# EAGLE design RADIO (EAGLE 9.4.2)
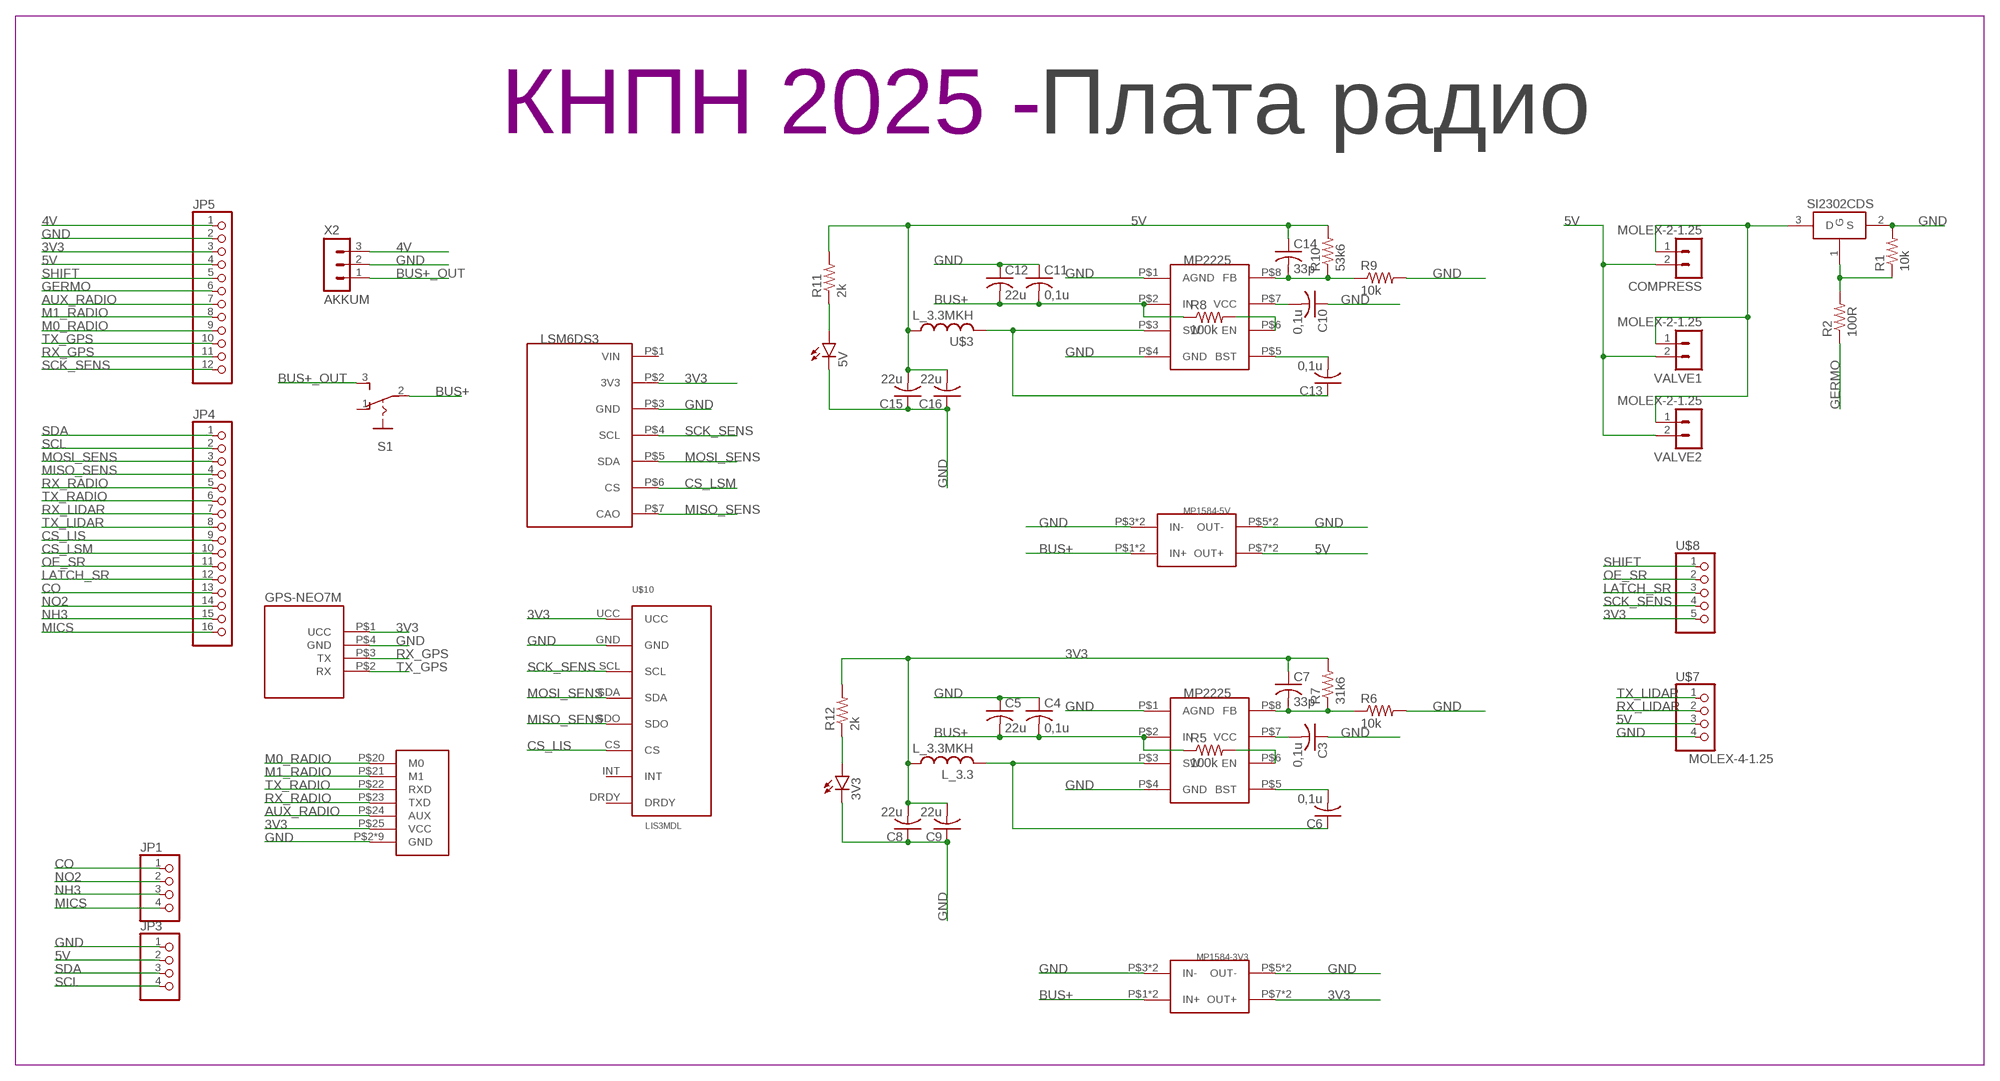
[diagram p0: schematic, sheet 1]

## Parts
3V3  LEDCHIP-LED0603  [CHIP-LED0603]
5V  LEDCHIP-LED0603  [CHIP-LED0603]
C3  0,1u  C-USC0603  [C0603]
C4  0,1u  C-USC1206  [C1206]
C5  22u  C-USC0603  [C0603]
C6  0,1u  C-USC0603  [C0603]
C7  33p  C-USC0603  [C0603]
C8  22u  C-USC1206  [C1206]
C9  22u  C-USC1206  [C1206]
C10  0,1u  C-USC0603  [C0603]
C11  0,1u  C-USC1206  [C1206]
C12  22u  C-USC0603  [C0603]
C13  0,1u  C-USC0603  [C0603]
C14  33p  C-USC0603  [C0603]
C15  22u  C-USC1206  [C1206]
C16  22u  C-USC1206  [C1206]
COMPRESS  MOLEX-2-1.25  [53047-02]
GPS-NEO7M  GPS-NEO7M  [GPS-NEO7M]
JP1  PINHD-1X4  [1X04]
JP3  PINHD-1X4  [1X04]
JP4  PINHD-1X16  [1X16]
JP5  PINHD-1X12  [1X12]
L_3.3  L_3.3MKH  L_3.3MKH_5X5  [L_SPM5020]
LSM6DS3  LSM6DS3  LSM6DS3_WITHOUT  [LSM6DS3_WITHOUT]
MP1584-3V3  MP1584-B  [MP1584-B]
MP1584-5V  MP1584  MP1584-B  [MP1584-B]
R1  10k  R-US_R0603  [R0603]
R2  100R  R-US_R0603  [R0603]
R5  100k  R-US_R0603  [R0603]
R6  10k  R-US_R0603  [R0603]
R7  31k6  R-US_R0603  [R0603]
R8  100k  R-US_R0603  [R0603]
R9  10k  R-US_R0603  [R0603]
R10  53k6  R-US_R0603  [R0603]
R11  2k  R-US_R0603  [R0603]
R12  2k  R-US_R0603  [R0603]
RADIO  E220-400T22S  [E220-400T22S]
S1  UNICS-SWITCHSS_12D11  [SS_12D11]
SI2302CDS  SI2302CDS  [SOT23-3]
U$1  Плата радио  LOGOPCB-""  [LOGO]
U$2  MP2225  [TSOT23-8]
U$3  L_3.3MKH  L_3.3MKH_5X5  [L_SPM5020]
U$5  MP2225  [TSOT23-8]
U$7  MOLEX-4-1.25  [53047-04]
U$8  MOLEX-5-1.25  [53047-05]
U$10  LIS3MDL  [LIS3MDL]
VALVE1  MOLEX-2-1.25  [53047-02]
VALVE2  MOLEX-2-1.25  [53047-02]
X2  AKKUM  JST-3-2.5  [JST-3-2.5]

## Nets
3V3: C7.1 C8.2 C9.2 GPS-NEO7M.P$1(UCC) JP5.3 L_3.3.P$1 LSM6DS3.P$2(3V3) MP1584-3V3.P$7(OUT+) MP1584-3V3.P$8(OUT+) R7.2 R12.2 RADIO.P$25(VCC) U$8.5 U$10.UCC
4V: JP5.1 X2.3
5V: C14.1 C15.2 C16.2 COMPRESS.2 JP3.2 JP5.4 MP1584-5V.P$7(OUT+) MP1584-5V.P$8(OUT+) R10.2 R11.2 U$3.P$1 U$7.3 VALVE1.2 VALVE2.2
AUX_RADIO: JP5.7 RADIO.P$24(AUX)
BUS+: C4.2 C5.2 C11.2 C12.2 MP1584-3V3.P$1(IN+) MP1584-3V3.P$2(IN+) MP1584-5V.P$1(IN+) MP1584-5V.P$2(IN+) R5.1 R8.1 S1.2(P) U$2.P$2(IN) U$5.P$2(IN)
BUS+_OUT: S1.3(S) X2.1
CO: JP1.1 JP4.13
CS_LIS: JP4.9 U$10.CS
CS_LSM: JP4.10 LSM6DS3.P$6(CS)
GERMO: JP5.6 R2.1
GND: 3V3.C 5V.C C3.1 C4.1 C5.1 C8.1 C9.1 C10.1 C11.1 C12.1 C15.1 C16.1 GPS-NEO7M.P$4(GND) JP3.1 JP5.2 LSM6DS3.P$3(GND) MP1584-3V3.P$3(IN-) MP1584-3V3.P$4(IN-) MP1584-3V3.P$5(OUT-) MP1584-3V3.P$6(OUT-) MP1584-5V.P$3(IN-) MP1584-5V.P$4(IN-) MP1584-5V.P$5(OUT-) MP1584-5V.P$6(OUT-) R1.2 R6.2 R9.2 RADIO.P$2(GND) RADIO.P$8(GND) RADIO.P$11(GND) RADIO.P$13(GND) RADIO.P$14(GND) RADIO.P$15(GND) RADIO.P$16(GND) RADIO.P$19(GND) RADIO.P$26(GND) SI2302CDS.2(S) U$2.P$1(AGND) U$2.P$4(GND) U$5.P$1(AGND) U$5.P$4(GND) U$7.4 U$10.GND X2.2
LATCH_SR: JP4.12 U$8.3
M0_RADIO: JP5.9 RADIO.P$20(M0)
M1_RADIO: JP5.8 RADIO.P$21(M1)
MICS: JP1.4 JP4.16
MISO_SENS: JP4.4 LSM6DS3.P$7(CAO) U$10.SDO
MOSI_SENS: JP4.3 LSM6DS3.P$5(SDA) U$10.SDA
N$2: R1.1 R2.2 SI2302CDS.1(G)
N$5: COMPRESS.1 SI2302CDS.3(D) VALVE1.1 VALVE2.1
N$9: C3.2 U$2.P$7(VCC)
N$10: R5.2 U$2.P$6(EN)
N$11: C6.2 U$2.P$5(BST)
N$12: C6.1 L_3.3.P$2 U$2.P$3(SW)
N$13: C7.2 R6.1 R7.1 U$2.P$8(FB)
N$14: C10.2 U$5.P$7(VCC)
N$15: R8.2 U$5.P$6(EN)
N$16: C13.2 U$5.P$5(BST)
N$17: C13.1 U$3.P$2 U$5.P$3(SW)
N$18: C14.2 R9.1 R10.1 U$5.P$8(FB)
N$19: 5V.A R11.1
N$20: 3V3.A R12.1
NH3: JP1.3 JP4.15
NO2: JP1.2 JP4.14
OE_SR: JP4.11 U$8.2
RX_GPS: GPS-NEO7M.P$3(TX) JP5.11
RX_LIDAR: JP4.7 U$7.2
RX_RADIO: JP4.5 RADIO.P$23(TXD)
SCK_SENS: JP5.12 LSM6DS3.P$4(SCL) U$8.4 U$10.SCL
SCL: JP3.4 JP4.2
SDA: JP3.3 JP4.1
SHIFT: JP5.5 U$8.1
TX_GPS: GPS-NEO7M.P$2(RX) JP5.10
TX_LIDAR: JP4.8 U$7.1
TX_RADIO: JP4.6 RADIO.P$22(RXD)
Unconnected: LSM6DS3.P$1(VIN) S1.1(O) U$10.DRDY U$10.INT

## Library data of the parts
3V3 5V = led:LED: LED OSRAM: - CHIPLED LG R971, LG N971, LY N971, LG Q971, LY Q971, LO R971, LY R971 LH N974, LH R974 LS Q976, LO Q976, LY Q976 LO Q996 - Hyper CHIPLED LW Q18S LB Q993, LB Q99A, LB R99A - SideLED LS A670, LO A670, LY A670, LG A670, LP A670 LB A673, LV A673, LT A673, LW A673 LH A674 LY A675 LS A676, LA A676, LO A676, LY A676, LW A676 LS A679, LY A679, LG A679 - Hyper Micro SIDELED® LS Y876, LA Y876, LO Y876, LY Y876 LT Y87S - SmartLED LW L88C, LW L88S LB L89C, LB L89S, LG L890 LS L89K, LO L89K, LY L89K LS L896, LA L896, LO L896, LY L896 - TOPLED LS T670, LO T670, LY T670, LG T670, LP T670 LSG T670, LSP T670, LSY T670, LOP T670, LYG T670 LG T671, LOG T671, LSG T671 LB T673, LV T673, LT T673, LW T673 LH T674 LS T676, LA T676, LO T676, LY T676, LB T676, LH T676, LSB T676, LW T676 LB T67C, LV T67C, LT T67C, LS T67K, LO T67K, LY T67K, LW E67C LS E67B, LA E67B, LO E67B, LY E67B, LB E67C, LV E67C, LT E67C LW T67C LS T679, LY T679, LG T679 LS T770, LO T770, LY T770, LG T770, LP T770 LB T773, LV T773, LT T773, LW T773 LH T774 LS E675, LA E675, LY E675, LS T675 LS T776, LA T776, LO T776, LY T776, LB T776 LHGB T686 LT T68C, LB T68C - Hyper Mini TOPLED® LB M676 - Mini TOPLED Santana® LG M470 LS M47K, LO M47K, LY M47K Source: http://www.osram.convergy.de LUXEON: - LUMILED® LXK2-PW12-R00, LXK2-PW12-S00, LXK2-PW14-U00, LXK2-PW14-V00 LXK2-PM12-R00, LXK2-PM12-S00, LXK2-PM14-U00 LXK2-PE12-Q00, LXK2-PE12-R00, LXK2-PE12-S00, LXK2-PE14-T00, LXK2-PE14-U00 LXK2-PB12-K00, LXK2-PB12-L00, LXK2-PB12-M00, LXK2-PB14-N00, LXK2-PB14-P00, LXK2-PB14-Q00 LXK2-PR12-L00, LXK2-PR12-M00, LXK2-PR14-Q00, LXK2-PR14-R00 LXK2-PD12-Q00, LXK2-PD12-R00, LXK2-PD12-S00 LXK2-PH12-R00, LXK2-PH12-S00 LXK2-PL12-P00, LXK2-PL12-Q00, LXK2-PL12-R00 Source: www.luxeon.com KINGBRIGHT: KA-3528ASYC Source: www.kingbright.com
C3-C16 = rcl:C-US: CAPACITOR, American symbol; SPICEPREFIX: C
COMPRESS VALVE1 VALVE2 = UNKNOWN-2024:MOLEX-2-1.25
GPS-NEO7M = UNKNOWN-2024:GPS-NEO7M
JP1 JP3 = pinhead:PINHD-1X4: PIN HEADER
JP4 = pinhead:PINHD-1X16: PIN HEADER
JP5 = pinhead:PINHD-1X12: PIN HEADER
L_3.3 U$3 = CanCubeSat:L_3.3MKH_5X5
LSM6DS3 = UNKNOWN-2024:LSM6DS3_WITHOUT
MP1584-3V3 MP1584-5V = UNKNOWN-2024:MP1584-B
R1 R2 R5-R12 = rcl:R-US_: RESISTOR, American symbol; SPICEPREFIX: R
RADIO = UNKNOWN-2024:E220-400T22S
S1 = UNKNOWN-2024:UNICS-SWITCH: SLIDING SWITCH Distributor Buerklin, 11G810
SI2302CDS = CanCubeSat:SI2302CDS
U$1 = UNKNOWN-2024:LOGO
U$2 U$5 = UNKNOWN-2024:MP2225
U$7 = UNKNOWN-2024:MOLEX-4-1.25
U$8 = UNKNOWN-2024:MOLEX-5-1.25
U$10 = UNKNOWN-2024:LIS3MDL
X2 = UNKNOWN-2024:JST-3-2.5

## Board
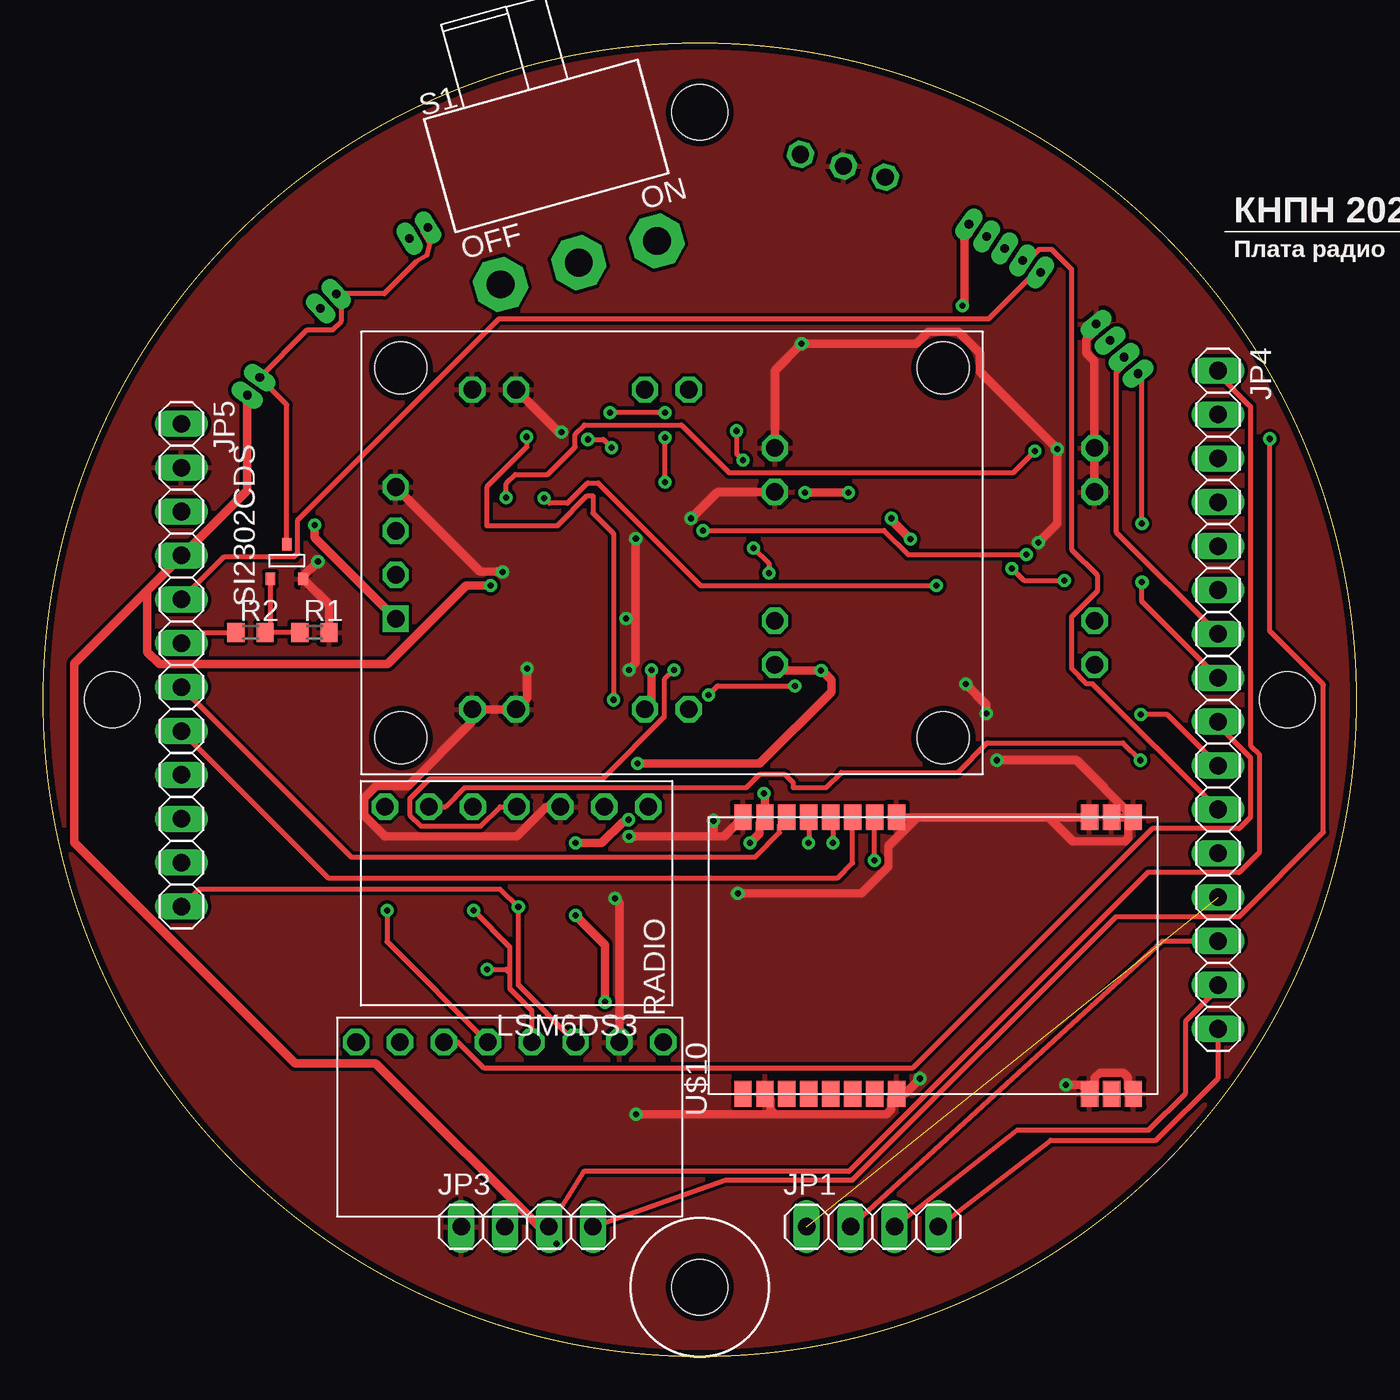
[diagram p1: board, top side]
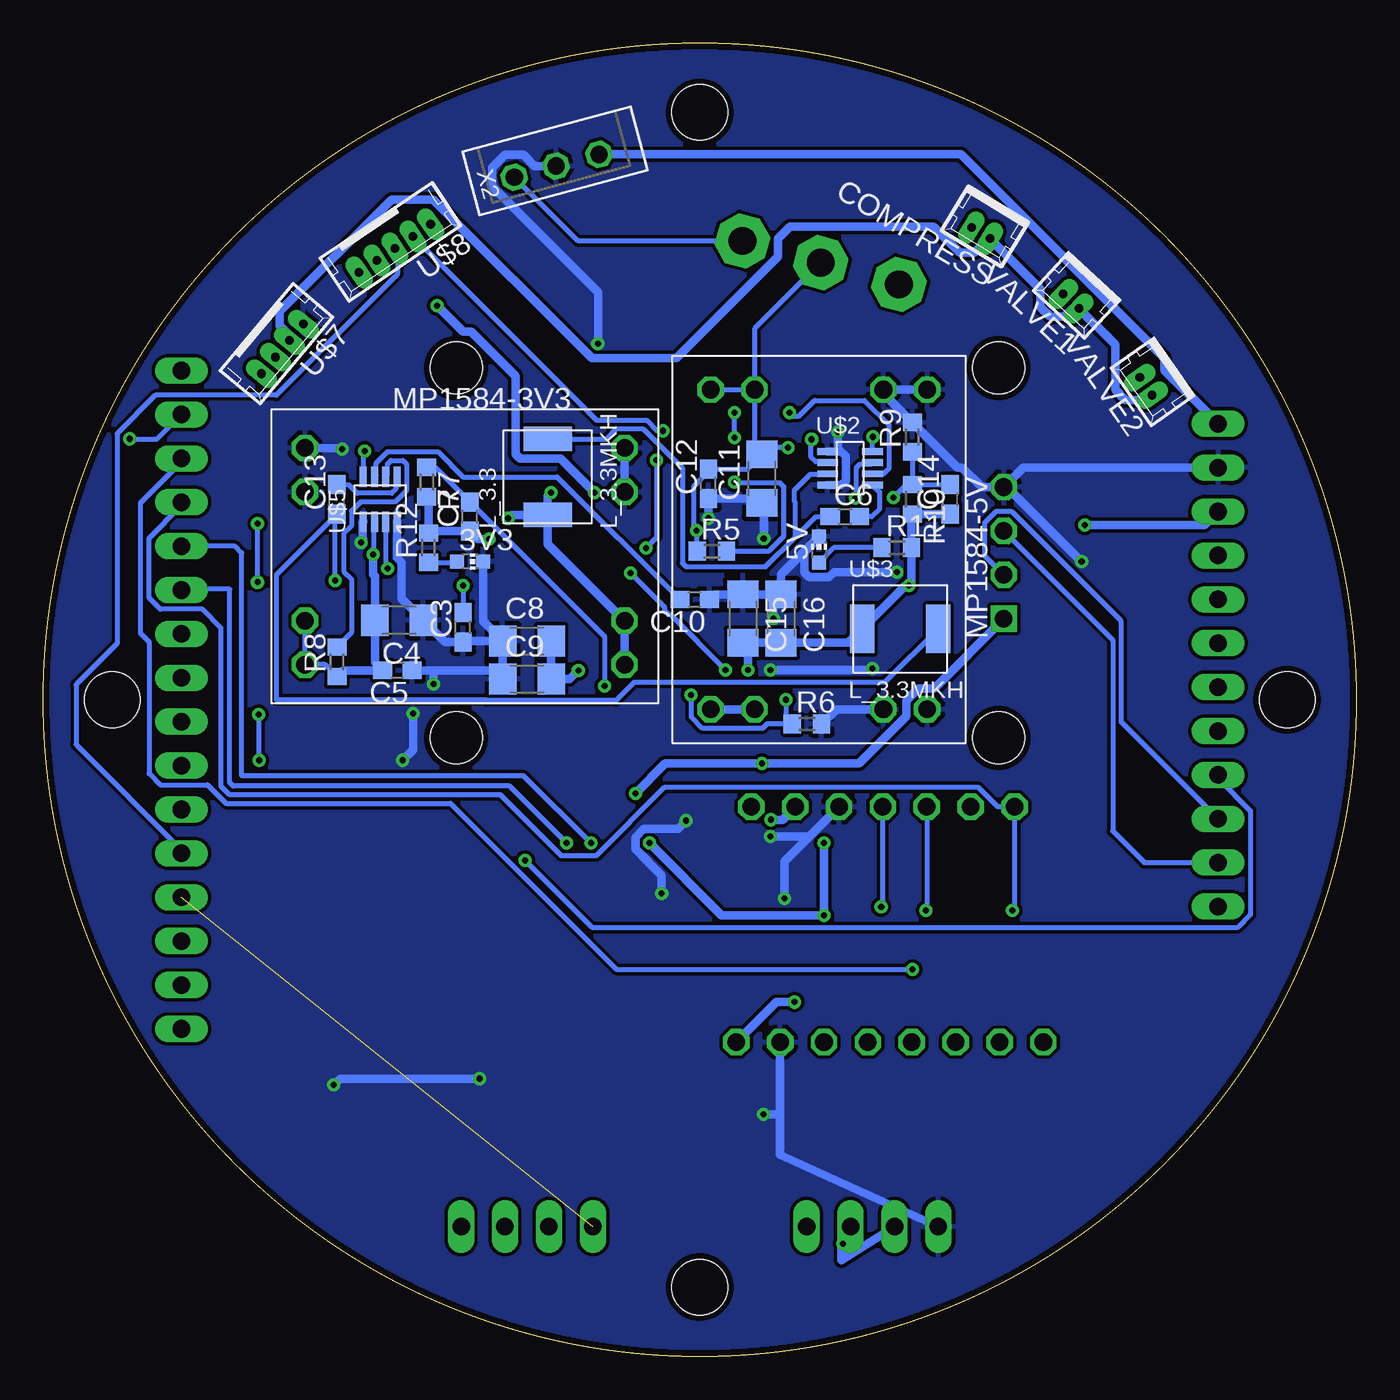
[diagram p2: board, bottom side, seen from below]

Size 76 x 76 mm. Coordinates in mm from the lower left corner, seen from the top.
Outline: circle at 38,38 radius 38
Copper layers (1*16): Top 0.035mm / dielectric 1.5mm / Bottom 0.035mm
Design rules "default *": minimum track width 0.3mm, minimum drill 0.35mm, track to track 0.2mm, track to pad 0.2mm, pad to pad 0.2mm, via to via 0.2mm, smd to smd 0.2mm, copper to edge 0.35mm, drill to drill 0.2mm, minimum pad ring 10mil, minimum via ring 8mil, stop-mask expansion 4mil, vias tented up to drill 0mil, thermal gap 10mil
Holes 3.2 mm at 38,72 72,38 38,4 4,38

### Footprints (pad centres in the part's own frame; a part is rotated, then mirrored left to right if it is on the bottom)
CHIP-LED0603 = smd 0.8 x 0.8: A 0,-0.75; C 0,0.75
C0603 = smd 1.1 x 1: 1 -0.85,0; 2 0.85,0
C1206 = smd 1.6 x 1.8: 1 -1.4,0; 2 1.4,0
53047-02 = drill 0.5 pad 0.698 long: 1 0.625,0.45; 2 -0.625,0.45
GPS-NEO7M = drill 1.016 square: P$1 -3.81,16 | drill 1.016 octagon: P$2 -1.27,16; P$3 1.27,16; P$4 3.81,16 | hole 3: -10.7,15.7; 10.7,15.7; 10.7,-15.7; -10.7,-15.7
1X04 = drill 1.016 long: 1 -3.81,0; 2 -1.27,0; 3 1.27,0; 4 3.81,0
1X16 = drill 1.016 long: 1 -19.05,0; 2 -16.51,0; 3 -13.97,0; 4 -11.43,0; 5 -8.89,0; 6 -6.35,0; 7 -3.81,0; 8 -1.27,0; 9 1.27,0; 10 3.81,0; 11 6.35,0; 12 8.89,0; 13 11.43,0; 14 13.97,0; 15 16.51,0; 16 19.05,0
1X12 = drill 1.016 long: 1 -13.97,0; 2 -11.43,0; 3 -8.89,0; 4 -6.35,0; 5 -3.81,0; 6 -1.27,0; 7 1.27,0; 8 3.81,0; 9 6.35,0; 10 8.89,0; 11 11.43,0; 12 13.97,0
L_SPM5020 = smd 1.4 x 2.8: P$1 -2.2,0; P$2 2.2,0
LSM6DS3_WITHOUT = drill 1.016 octagon: P$1 -7.62,-5; P$2 -5.08,-5; P$3 -2.54,-5; P$4 0,-5; P$5 2.54,-5; P$6 5.08,-5; P$7 7.62,-5
MP1584-B = drill 1.016 octagon: P$1 -9.25,-6.27; P$2 -9.25,-3.73; P$3 -9.25,3.73; P$4 -9.25,6.27; P$5 9.25,6.27; P$6 9.25,3.73; P$7 9.25,-3.73; P$8 9.25,-6.27
R0603 = smd 1 x 1.1: 1 -0.85,0; 2 0.85,0
E220-400T22S = smd 1.5 x 1: P$1 -8,11; P$2 -8,9.73; P$3 -8,8.46; P$4 -8,7.19; P$5 -8,5.92; P$6 -8,4.65; P$7 -8,3.38; P$8 -8,2.11; P$11 -8,-9.06; P$12 -8,-10.33; P$13 -8,-11.6; P$14 8,-11.6; P$15 8,-10.33; P$16 8,-9.06; P$19 8,2.11; P$20 8,3.38; P$21 8,4.65; P$22 8,5.92; P$23 8,7.19; P$24 8,8.46; P$25 8,9.73; P$26 8,11
SS_12D11 = drill 1.6 pad 3 octagon: 1 -4.7,0; 2 0,0; 3 4.7,0
SOT23-3 = smd 0.56 x 0.73: 1 -0.95,-1; 2 0.95,-1; 3 0,1
TSOT23-8 = smd 0.4 x 1.2: P$1 -0.975,-1.3; P$2 -0.325,-1.3; P$3 0.325,-1.3; P$4 0.975,-1.3; P$5 0.975,1.3; P$6 0.325,1.3; P$7 -0.325,1.3; P$8 -0.975,1.3
53047-04 = drill 0.5 pad 0.698 long: 1 1.875,0.45; 2 0.625,0.45; 3 -0.625,0.45; 4 -1.875,0.45
53047-05 = drill 0.5 pad 0.698 long: 1 2.5,0.45; 2 1.25,0.45; 3 0,0.45; 4 -1.25,0.45; 5 -2.5,0.45
LIS3MDL = drill 1.016 octagon: CS -5.08,-3.81; DRDY -5.08,-8.89; GND -5.08,6.35; INT -5.08,-6.35; SCL -5.08,3.81; SDA -5.08,1.27; SDO -5.08,-1.27; UCC -5.08,8.89
JST-3-2.5 = drill 1 pad 1.5 octagon: 1 2.52,0; 2 0.02,0; 3 -2.56,0

### Placement (x,y rotation side)
3V3  51.3,46 270 bottom
5V  31.1,46.7 0 bottom
C3  51.7,42.2 90 bottom
C4  55.4,42.6 180 bottom
C5  55.5,39.7 180 bottom
C6  29.6,48.6 0 bottom
C7  51.3,48.6 90 bottom
C8  48,41.4 0 bottom
C9  48,39.2 0 bottom
C10  38.3,43.8 180 bottom
C11  34.4,50.8 90 bottom
C12  37.5,50.5 90 bottom
C13  59,49.6 90 bottom
C14  23.5,49.6 90 bottom
C15  35.5,42.7 270 bottom
C16  33.3,42.7 270 bottom
COMPRESS  21.5,65.4 149 bottom
GPS-NEO7M  36.4,46.5 90 top
JP1  48,7.5 0 top
JP3  28,7.5 0 top
JP4  68,38 270 top
JP5  8,40 270 top
L_3.3  46.8,50.9 90 bottom
LSM6DS3  27.4,26.8 180 top
MP1584-3V3  51.6,46.3 0 bottom
MP1584-5V  31.1,46.7 270 bottom
R1  15.7,41.9 0 top
R2  12,41.9 0 top
R5  37.3,46.6 0 bottom
R6  31.8,36.6 0 bottom
R7  53.8,50.6 270 bottom
R8  59,40.2 90 bottom
R9  25.7,53.2 90 bottom
R10  25.7,49.6 270 bottom
R11  26.6,46.8 0 bottom
R12  53.7,46.8 90 bottom
RADIO  51.5,23.2 90 top
S1  31,63.3 15.5 top
SI2302CDS  14.1,46 0 top
U$1  68.4,65.1 0 top
U$2  29.3,51.4 270 bottom
U$3  26.4,42.1 0 bottom
U$5  56.5,49.6 0 bottom
U$7  62.5,58.6 230 bottom
U$8  55.9,64.5 214 bottom
U$10  27,13.1 270 top
VALVE1  16.2,61.4 137 bottom
VALVE2  11.8,56.4 125 bottom
X2  46.3,68.9 195 bottom

### Tracks (layer width: path | path; a pad name or v marks a point on that pad's centre or on a via)
3V3  (via drill 0.35)
  Top 0.5: v33.87,31.06 33.74,30.93 33.56,30.93 32.33,29.7 v30.8,29.7 | v30.8,25.53 32.52,23.81 v32.52,20.5 | v40.9,29.7 40.9,29.71 41.45,30.26 41.45,30.88 RADIO.P$25 41.77,32.53 v41.72,32.58 | MP1584-3V3.P$8 42.68,39.7 v45.03,39.7 45.07,39.7 45.63,39.14 45.63,38.46 41.47,34.3 v34.4,34.3 | GPS-NEO7M.P$1 15.7,47.39 v15.7,48.1 | U$8.5 53.58,65 53.32,64.74 53.32,60.92 v53.2,60.8 | v46.6,50 v44.1,50 | v50.2,47.3 49.1,48.4 v49.1,48.5
  Bottom 0.5: LSM6DS3.P$2 33.22,31.06 v33.87,31.06 | v30.8,29.7 v30.8,25.53 36.73,25.53 v40.9,29.7 | v32.52,20.5 33.57,20.5 U$10.UCC | MP1584-3V3.P$8 MP1584-3V3.P$7 46.8,47.02 L_3.3.P$1 | v45.03,39.7 45.53,39.2 C9.2 C8.2 | GPS-NEO7M.P$1 24.43,38.66 25.33,38.66 26.04,37.95 26.04,37.05 28.79,34.3 v34.4,34.3 40,34.3 v41.72,32.58 | v15.7,48.1 8.79,48.1 JP5.3 | v44.1,50 46.05,51.95 48.39,51.95 48.65,52.21 48.65,56.72 51.23,59.3 51.7,59.3 v53.2,60.8 | v46.6,50 46.8,49.8 L_3.3.P$1 | L_3.3.P$1 48.9,48.7 v49.1,48.5 | v50.2,47.3 50.85,47.3 C7.1 53.6,47.75 R12.2 53.7,49.65 R7.2
4V
  Bottom 0.5: JP5.1 11.11,57.08 11.11,57.78 22.89,69.56 X2.3
5V  (via drill 0.35)
  Top 0.5: v29.7,6.5 19.23,16.97 14.59,16.97 1.8,29.75 1.8,40.09 6.03,44.31 | 8,46.29 JP5.4 | 8,46.29 11.81,50.1 VALVE2.2 | 8,46.29 6.03,44.31 | 6.03,44.31 6.03,40.77 6.74,40.06 19.93,40.06 24.47,44.6 v25.9,44.6 | v35.2,39.73 35.2,37.82 MP1584-5V.P$7
  Bottom 0.5: JP3.2 29.8,5.57 29.8,6.4 v29.7,6.5 | VALVE2.2 12.17,55.63 12.45,55.36 13.36,55.36 13.95,55.95 13.95,58.54 VALVE1.2 16.42,60.64 16.91,60.16 17.71,60.16 18.27,60.73 18.27,61.77 COMPRESS.2 21.3,64.69 22.1,63.88 22.95,63.88 24.46,65.39 32.77,65.39 33.47,64.69 33.47,63.66 39.35,57.77 44.24,57.77 53.43,66.95 55.84,66.95 62.32,60.48 62.32,59.66 61.75,59.1 U$7.3 | MP1584-5V.P$7 MP1584-5V.P$8 | v35.2,39.73 35.2,41 C15.2 C16.2 29.4,41.3 U$3.P$1 26.1,44.6 v25.9,44.6 25.75,44.75 R11.2 25.75,48.7 R10.2 C14.1
AUX_RADIO
  Top 0.3: JP5.7 17.83,28.9 41.22,28.9 42.62,30.3 42.62,30.78 RADIO.P$24
BUS+  (via drill 0.35)
  Top 0.3: v31.52,53.07 32.43,53.07 v32.9,52.6 | v38.2,47.8 48.67,47.8 50.07,46.4 v56.9,46.4
  Bottom 0.3: MP1584-5V.P$1 MP1584-5V.P$2 | R8.1 59.68,40.03 MP1584-3V3.P$1 MP1584-3V3.P$2 | S1.2 34.83,59.47 MP1584-5V.P$2 | U$2.P$2 30.65,51.77 31.3,51.77 31.55,52.03 31.55,52.72 31.52,52.75 v31.52,53.07 | R5.1 38.2,46.65 v38.2,47.8 38.35,47.8 38.35,50.34 37.5,51.2 C12.2 35.25,51.35 C11.2 | v56.9,46.4 56.9,46.77 56.87,46.8 56.87,48.25 U$5.P$2 | v32.9,52.6 34,52.6 C11.2 | MP1584-5V.P$2 34.83,52.63 C11.2
  Bottom 0.5: R8.1 58.65,39.7 C5.2 56.8,40.15 C4.2 56.8,45.16 56.9,45.26 v56.9,46.4
BUS+_OUT
  Bottom 0.3: S1.3 45.04,64.56 X2.1
CO  (1 unrouted)
CS_LIS
  Top 0.3: JP4.9 68,36.52 69.87,34.65 69.87,31.19 69.22,30.54 64.18,30.54 50.34,16.7 25.5,16.7 24.02,18.18 U$10.CS
CS_LSM  (via drill 0.35)
  Top 0.3: LSM6DS3.P$6 23.29,31.8 24.4,32.91 40.7,32.91 41.49,33.7 42.9,33.7 43.4,33.2 43.4,32.91 45.3,32.91 46.19,33.8 52.93,33.8 54.63,35.5 62.5,35.5 v63.5,34.5 | JP4.10 65.05,37.14 v63.54,37.14
  Bottom 0.3: v63.54,37.14 63.54,34.54 v63.5,34.5
GERMO
  Top 0.3: JP5.6 8.63,41.9 R2.1
GND  (via drill 0.35)
  Top 0.5: v15.9,46 15.05,45.15 SI2302CDS.2 16.55,43.5 R1.2 | v33.1,26.5 33.35,26.25 U$10.GND | RADIO.P$26 39.4,30.1 38.7,30.1 | 38.7,30.1 v33.9,30.1 | LSM6DS3.P$3 29.11,31.8 27.4,30.09 19.78,30.09 18.57,31.3 18.57,32.3 19.28,33.01 21.11,33.01 24.83,36.73 MP1584-5V.P$5 MP1584-5V.P$6 28,38.08 v28,39.8 | v33.9,39.73 34.3,40.12 34.3,42.7 | MP1584-5V.P$3 29.82,53.5 v30,53.5 | v37.5,48.5 39.03,50.03 MP1584-3V3.P$6 | MP1584-3V3.P$5 42.35,57.05 v43.9,58.6 50.53,58.6 51.23,59.3 52.97,59.3 54.2,58.07 54.2,57 v58.7,52.5 58.7,48.2 v57.6,47.1 | U$7.4 60.95,59.44 60.38,58.87 60.38,58.06 60.85,57.59 MP1584-3V3.P$4 MP1584-3V3.P$3 | v34.3,47.33 34.3,42.7 | v33.73,42.7 34.3,42.7 | RADIO.P$16 58.2,31.2 | 58.2,31.2 50.6,31.2 | 50.6,31.2 RADIO.P$19 | RADIO.P$14 62.8,30.9 62.8,30 62.6,29.8 59.6,29.8 58.2,31.2 | RADIO.P$14 59.8,34.5 v55.2,34.5 | v54.6,37.2 54.6,37.7 v53.4,38.9 | 42.35,14 42.09,14.26 42.09,14.88 RADIO.P$2 | 42.35,14 48.81,14 49.07,14.26 49.07,14.88 RADIO.P$8 49.87,15.2 v50.74,16.07 | 42.35,14 v34.3,14 | v26.6,45.4 26.27,45.4 26.24,45.43 25.28,45.43 GPS-NEO7M.P$4 | 50.6,31.2 48.93,29.53 48.93,28.36 47.37,26.8 v40.2,26.8 | v38.8,31 38.8,30.2 38.7,30.1 | v59.2,15.7 60.06,15.7 RADIO.P$11 60.88,15.52 60.88,16.14 61.14,16.4 62.52,16.4 62.78,16.14 62.78,15.52 RADIO.P$13 | RADIO.P$15 RADIO.P$14
  Bottom 0.5: MP1584-5V.P$4 MP1584-5V.P$3 27.37,55.72 R9.2 23.1,51.45 22.81,51.45 21.67,50.31 GPS-NEO7M.P$4 | JP5.2 19.28,51.43 GPS-NEO7M.P$4 | GPS-NEO7M.P$4 20.21,50.31 v15.9,46 | JP3.1 33.35,11.66 33.35,14 | 33.35,14 U$10.GND | LSM6DS3.P$3 31.64,30.1 | 31.64,30.1 33.1,28.64 v33.1,26.5 | v33.9,30.1 31.64,30.1 | MP1584-5V.P$6 30.1,37.45 R6.2 | C16.1 C15.1 37.15,44.1 C10.1 | C16.1 33.3,45.25 5V.C 31.1,47.39 31.95,46.54 31.95,45.36 31.69,45.1 30.51,45.1 30.21,45.4 v26.6,45.4 | v33.9,39.73 28.07,39.73 v28,39.8 | U$2.P$4 29.81,50.42 29.55,50.69 29.55,52.11 29.81,52.38 | 29.81,52.38 U$2.P$1 | v30,53.5 30,52.56 29.81,52.38 | v37.5,48.5 C12.1 34.65,49.65 C11.1 34.3,49.3 v34.3,47.33 | MP1584-3V3.P$6 MP1584-3V3.P$5 | v43.9,58.6 43.9,61.59 50.03,67.71 50.03,68.78 49.27,69.54 48.2,69.54 47.55,68.89 X2.2 | C5.1 53.4,39.7 | C8.1 51.65,41.4 C3.1 52.75,41.35 C4.1 55.24,43.84 55.24,45.94 55.53,46.22 U$5.P$4 | 3V3.C 50.55,42.55 C8.1 | U$5.P$1 57.5,48.27 57.5,47.2 v57.6,47.1 | v58.7,52.5 58.77,52.57 MP1584-3V3.P$4 | C16.1 33.73,43.67 v33.73,42.7 | v55.2,34.5 54.6,35.1 v54.6,37.2 | v53.4,38.9 53.4,39.7 | v34.3,14 33.35,14 | v40.2,26.8 40.2,27.83 41.73,29.36 41.73,30.04 41.24,30.53 39.27,30.53 v38.8,31 | v50.74,16.07 58.83,16.07 v59.2,15.7 | C8.1 49.4,39.5 | 49.4,39.5 C9.1 | 53.4,39.7 49.6,39.7 49.4,39.5
  pour Top: -11,79 103.4,79 103.4,-14.2 -11,-14.2
  pour Bottom: -12,80 110.7,80 110.7,-18.1 -12,-18.1
LATCH_SR
  Bottom 0.3: U$8.3 55.65,63.56 55.5,63.41 55.5,62.64 62.51,55.62 69.51,55.62 71.73,53.4 71.73,41.24 74.1,38.87 74.1,35.41 68,29.31 JP4.12
M0_RADIO  (via drill 0.35)
  Top 0.3: v48.1,28.7 48.1,31.18 RADIO.P$20
  Bottom 0.3: JP5.9 8,33.45 6.13,31.57 6.13,25.57 6.89,24.8 44.2,24.8 v48.1,28.7
M1_RADIO
  Top 0.3: JP5.8 16.49,27.7 46,27.7 46.85,28.55 RADIO.P$21
MICS
  Top 0.3: JP1.4 58.31,12.5 64.4,12.5 68,16.1 JP4.16
MISO_SENS  (via drill 0.35)
  Top 0.3: v19.9,25.8 19.9,24.01 U$10.SDO
  Bottom 0.3: v19.9,25.8 19.78,25.92 LSM6DS3.P$7 20.75,31.8 21.86,32.91 40.06,32.91 44,28.97 46,28.97 49.53,32.5 65.21,32.5 65.7,32.99 65.7,42.16 66.78,43.24 69.22,43.24 69.87,43.89 69.87,47.35 68,49.23 JP4.4
MOSI_SENS  (via drill 0.35)
  Top 0.3: v24.9,25.8 27,23.7 27,22.2 | 27,22.2 27,21.28 28.27,20.01 U$10.SDA | v25.7,22.4 26.8,22.4 27,22.2
  Bottom 0.3: LSM6DS3.P$5 24.86,25.84 v24.9,25.8 | v25.7,22.4 42.83,22.4 52.43,32 65.41,32 66.49,33.08 69.22,33.08 69.87,33.73 69.87,41.35 70.37,41.85 70.37,49.39 68,51.77 JP4.3
N$2
  Top 0.3: SI2302CDS.1 13.15,42.2 R2.2 R1.1
N$5
  Top 0.3: SI2302CDS.3 14.1,55.08 VALVE2.1 15.28,59.41 16.75,59.41 17.26,59.92 17.26,60.63 16.96,60.92 VALVE1.1 19.74,61.5 21.59,63.35 22.2,63.71 22.37,64.4 21.98,65.05 COMPRESS.1
N$9  (via drill 0.35)
  Top 0.3: v51.7,44.6 38.05,44.6 32.11,50.54 31.51,50.54 30.35,49.38 29.3,49.38 v29,49.68
  Bottom 0.3: U$2.P$7 28.1,51.62 28.74,51.62 28.95,51.42 28.95,49.73 v29,49.68 | v51.7,44.6 C3.2
N$10  (via drill 0.35)
  Top 0.3: v36,50.6 v36,53.17 | v36,54.63 v32.8,54.63
  Bottom 0.3: R5.2 33.99,46.6 33.15,47.45 33.15,50.34 33.35,50.55 35.95,50.55 v36,50.6 | U$2.P$6 27.35,51.08 27.05,51.38 27.05,53.92 28.45,55.33 31.35,55.33 32.25,54.43 32.6,54.43 v32.8,54.63 | v36,53.17 v36,54.63
N$11
  Bottom 0.3: U$2.P$5 27.6,50.02 27.6,49.05 28.05,48.6 C6.2
N$12
  Bottom 0.3: L_3.3.P$2 43.39,53.1 42.81,53.68 41.29,53.68 39,51.4 39,45.91 38.8,45.7 34.19,45.7 32.49,47.39 | 32.49,47.39 31.29,48.6 C6.1 | U$2.P$3 30.65,51.02 31.63,51.02 32.54,50.11 32.54,49.51 32.49,49.46 32.49,47.39
N$13  (via drill 0.35)
  Top 0.3: v33,38 33,47.62 31.81,48.81 31.81,49.81 31.49,49.81 29.76,48.08 25.67,48.08 25.67,50.3 27.98,52.61 v27.98,53.22 | v38.5,38.27 39.03,38.8 v43.5,38.8
  Bottom 0.3: v33,38 33,36.95 R6.1 34.11,36.6 34.37,36.34 37.83,36.34 38.48,36.99 38.48,38.25 v38.5,38.27 | v43.5,38.8 43.5,41.65 C7.2 53.3,51.45 R7.1 | v27.98,53.22 28,53.2 U$2.P$8
N$14
  Bottom 0.3: C10.2 46.25,50.9 51.7,50.9 53.16,52.35 56.08,52.35 56.72,51.7 56.72,51 U$5.P$7
N$15
  Bottom 0.3: R8.2 58.15,41.9 58.15,44.98 58.6,45.43 58.6,47.6 58.15,48.05 58.15,48.92 57.62,49.45 55.62,49.45 54.97,50.1 54.97,51.65 55.18,51.85 55.87,51.85 56.08,51.65 56.08,51 U$5.P$6
N$16
  Bottom 0.3: C13.2 58.32,50.45 57.82,49.95 55.83,49.95 55.58,50.2 55.58,50.85 U$5.P$5
N$17  (via drill 0.35)
  Top 0.3: v56.07,45.6 56.77,44.9 v59.1,44.9
  Bottom 0.3: U$3.P$2 27.3,39 41.81,39 42.86,37.95 50.34,37.95 50.4,38 62.5,38 62.5,45.25 C13.1 59.1,48.65 v59.1,44.9 | U$5.P$3 56.17,45.7 v56.07,45.6
N$18  (via drill 0.35)
  Top 0.3: v57.4,52.4 56.14,51.14 39.7,51.14 36.94,53.9 31.32,53.9 30.79,53.37 30.79,52.64 29.2,51.04 27.33,51.04 26.8,50.51 v26.8,49.7
  Bottom 0.3: R9.1 R10.1 | R10.1 C14.2 | R10.1 26.05,50.45 v26.8,49.7 | v57.4,52.4 57.47,52.33 U$5.P$8
N$19
  Bottom 0.3: R11.1 30.25,46.8 5V.A
N$20
  Bottom 0.3: R12.1 52.1,45.95 3V3.A
NH3
  Top 0.3: JP1.3 56.37,13.1 64,13.1 66.13,15.23 66.13,19.41 68,21.28 JP4.15
NO2
  Top 0.3: JP1.2 64.76,24.03 JP4.14
OE_SR
  Top 0.3: JP4.11 60.73,38.92 60.39,38.92 59.51,39.8 59.51,42.8 61,44.29 61,45.21 59.51,46.7 59.51,62.92 58.38,64.05 57.63,64.05 57,63.43 U$8.2
RX_GPS
  Bottom 0.3: GPS-NEO7M.P$3 14.1,41.47 14.1,30.4 12.27,28.57 JP5.11
RX_LIDAR
  Top 0.3: U$7.2 62.56,57.38 62.09,56.92 62.09,47.72 JP4.7
RX_RADIO  (via drill 0.35)
  Top 0.3: RADIO.P$23 v44.31,29.71 v44.3,29.7
  Bottom 0.3: v44.3,29.7 48.2,33.6 64.5,33.6 64.5,46.5 64.89,46.89 JP4.5
SCK_SENS  (via drill 0.35)
  Top 0.3: JP5.12 9,27.03 26.47,27.03 v27.5,26 27.5,21.49 U$10.SCL | v40.14,53.56 40.14,52.24 v40.51,51.87 | v41.11,46.79 42,45.9 v42,45.33 | v36.5,39.73 35.94,39.17 35.94,36.99 32.37,33.41 22.36,33.41 21.21,32.26 21.21,31.34 21.86,30.69 25.32,30.69 26.43,31.8 LSM6DS3.P$4
  Bottom 0.3: v27.5,26 27.4,26.1 LSM6DS3.P$4 | v40.14,53.56 40.46,53.56 41.08,54.18 43.97,54.18 U$8.4 | v40.51,51.87 40.51,47.4 v41.11,46.79 | v42,45.33 40.05,43.38 40.05,43.16 39.84,42.95 39.72,42.95 v36.5,39.73
SCL  (via drill 0.35)
  Top 0.3: JP3.4 39.51,10.2 46.84,10.2 62.1,25.46 69.22,25.46 74.1,30.34 74.1,38.87 71,41.97 v71,53.1
  Bottom 0.3: v71,53.1 69.41,53.1 JP4.2
SDA
  Top 0.3: JP4.1 68,56.84 69.87,54.97 69.87,35.36 70.37,34.86 70.37,29.15 69.22,28 63.93,28 46.63,10.7 31.3,10.7 31.27,10.67 JP3.3
SHIFT
  Top 0.3: U$8.1 57.4,62.73 54.73,60.06 26.38,60.06 14.73,48.4 14.73,46.49 14.52,46.28 10.48,46.28 JP5.5
TX_GPS
  Bottom 0.3: JP5.10 13.6,36.71 13.6,42.54 19.94,48.88 20.86,48.88 21.51,48.23 21.51,46.34 GPS-NEO7M.P$2
TX_LIDAR  (via drill 0.35)
  Top 0.3: JP4.8 63.6,43.67 v63.6,44.8 | v63.6,48.2 63.6,56.64 U$7.1
  Bottom 0.3: v63.6,44.8 v63.6,48.2
TX_RADIO  (via drill 0.35)
  Top 0.3: RADIO.P$22 45.7,31.08 v45.7,29.7
  Bottom 0.3: v45.7,29.7 49,33 65,33 65.2,33.2 65.2,44.4 67.95,44.4 JP4.6